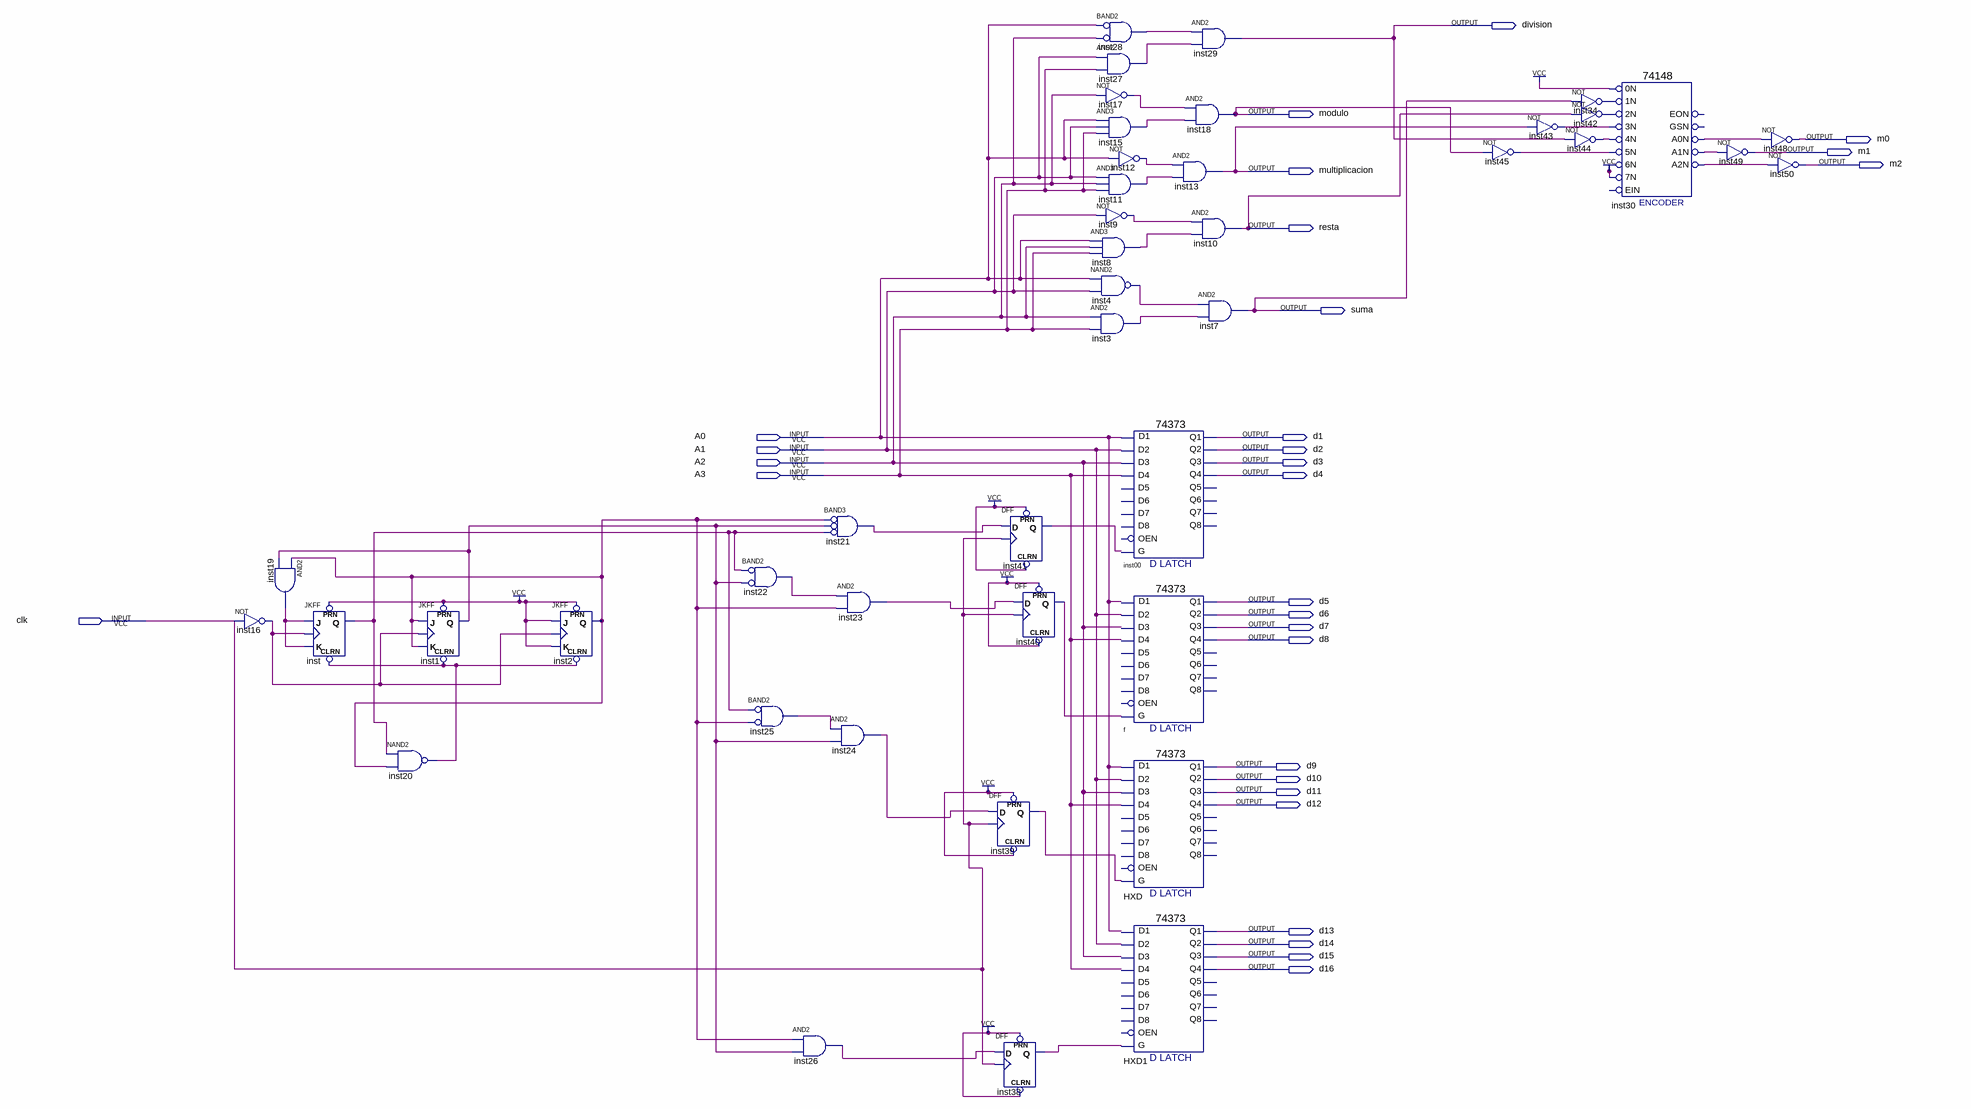
[diagram p0: schematic sheet]
// Quartus schematic Teclado.bdf as structural Verilog: 44 symbols, 29 pins
module Teclado (
  input  A0,
  input  A1,
  input  A2,
  input  A3,
  input  clk,
  output division,
  output modulo,
  output m0,
  output m1,
  output m2,
  output multiplicacion,
  output resta,
  output suma,
  output d1,
  output d2,
  output d3,
  output d4,
  output d5,
  output d6,
  output d7,
  output d8,
  output d9,
  output d10,
  output d11,
  output d12,
  output d13,
  output d14,
  output d15,
  output d16
);

  wire inst1_q, inst2_q, inst3_out, inst4_out, inst8_out, inst9_out, inst11_out, inst12_out, inst15_out,
       inst16_out, inst17_out, inst19_out, inst20_out, inst21_out, inst22_out, inst23_out, inst24_out,
       inst25_out, inst26_out, inst27_out, inst28_out, inst30_a0n, inst30_a1n, inst30_a2n, inst34_out,
       inst38_q, inst39_q, inst40_q, inst41_q, inst42_out, inst43_out, inst44_out, inst45_out, inst_q;

  not inst16 (inst16_out, clk);
  and inst19 (inst19_out, inst2_q, inst1_q);
  JKFF inst (.PRN(1'b1), .CLRN(inst20_out), .K(inst19_out), .J(inst19_out), .CLK(inst16_out), .Q(inst_q));
  nand inst20 (inst20_out, inst_q, inst2_q);
  JKFF inst1 (.PRN(1'b1), .CLRN(inst20_out), .K(inst2_q), .J(inst2_q), .CLK(inst16_out), .Q(inst1_q));
  JKFF inst2 (.PRN(1'b1), .CLRN(inst20_out), .K(1'b1), .J(1'b1), .CLK(inst16_out), .Q(inst2_q));
  and inst22 (inst22_out, ~inst_q, ~inst1_q);  // BAND2
  and inst25 (inst25_out, ~inst_q, ~inst2_q);  // BAND2
  and inst26 (inst26_out, inst2_q, inst1_q);
  and inst21 (inst21_out, ~inst2_q, ~inst1_q, ~inst_q);  // BAND3
  and inst23 (inst23_out, inst22_out, inst2_q);
  and inst24 (inst24_out, inst25_out, inst1_q);
  DFF inst41 (.CLRN(1'b1), .CLK(clk), .D(inst21_out), .PRN(1'b1), .Q(inst41_q));
  DFF inst40 (.CLRN(1'b1), .CLK(clk), .D(inst23_out), .PRN(1'b1), .Q(inst40_q));
  DFF inst39 (.CLRN(1'b1), .CLK(clk), .D(inst24_out), .PRN(1'b1), .Q(inst39_q));
  DFF inst38 (.CLRN(1'b1), .CLK(clk), .D(inst26_out), .PRN(1'b1), .Q(inst38_q));
  and inst28 (inst28_out, ~A0, ~A2);  // BAND2
  and inst27 (inst27_out, A1, A3);
  not inst17 (inst17_out, A2);
  and inst15 (inst15_out, A0, A1, A3);
  not inst12 (inst12_out, A0);
  and inst11 (inst11_out, A1, A2, A3);
  not inst9 (inst9_out, A1);
  and inst8 (inst8_out, A0, A2, A3);
  nand inst4 (inst4_out, A0, A1);
  and inst3 (inst3_out, A2, A3);
  \74373  inst00 (
    .D1(A0), .D3(A2), .D2(A1), .G(inst41_q), .D4(A3), .Q3(d3), .Q2(d2), .Q4(d4), .Q1(d1));  // open: D6, D7, D5, D8, OEN, Q6, Q7, Q8, Q5
  \74373  f (
    .D1(A0), .D3(A2), .D2(A1), .G(inst40_q), .D4(A3), .Q3(d7), .Q2(d6), .Q4(d8), .Q1(d5));  // open: D6, D7, D5, D8, OEN, Q6, Q7, Q8, Q5
  \74373  HXD (
    .D1(A0), .D3(A2), .D2(A1), .G(inst39_q), .D4(A3), .Q3(d11), .Q2(d10), .Q4(d12), .Q1(d9));  // open: D6, D7, D5, D8, OEN, Q6, Q7, Q8, Q5
  \74373  HXD1 (
    .D1(A0), .D3(A2), .D2(A1), .G(inst38_q), .D4(A3), .Q3(d15), .Q2(d14), .Q4(d16), .Q1(d13));  // open: D6, D7, D5, D8, OEN, Q6, Q7, Q8, Q5
  and inst13 (multiplicacion, inst12_out, inst11_out);
  and inst29 (division, inst28_out, inst27_out);
  and inst18 (modulo, inst17_out, inst15_out);
  and inst10 (resta, inst9_out, inst8_out);
  and inst7 (suma, inst4_out, inst3_out);
  not inst43 (inst43_out, multiplicacion);
  not inst45 (inst45_out, modulo);
  not inst34 (inst34_out, suma);
  not inst42 (inst42_out, resta);
  not inst44 (inst44_out, division);
  \74148  inst30 (
    .\5N (inst45_out), .\0N (1'b1), .\1N (inst34_out), .\2N (inst42_out), .\3N (inst43_out),
    .\4N (inst44_out), .\6N (1'b1), .\7N (1'b1), .A1N(inst30_a1n), .A0N(inst30_a0n), .A2N(inst30_a2n));  // open: EIN, EON, GSN
  not inst49 (m1, inst30_a1n);
  not inst48 (m0, inst30_a0n);
  not inst50 (m2, inst30_a2n);
endmodule
